# Altium project BiasTee.PrjPcb
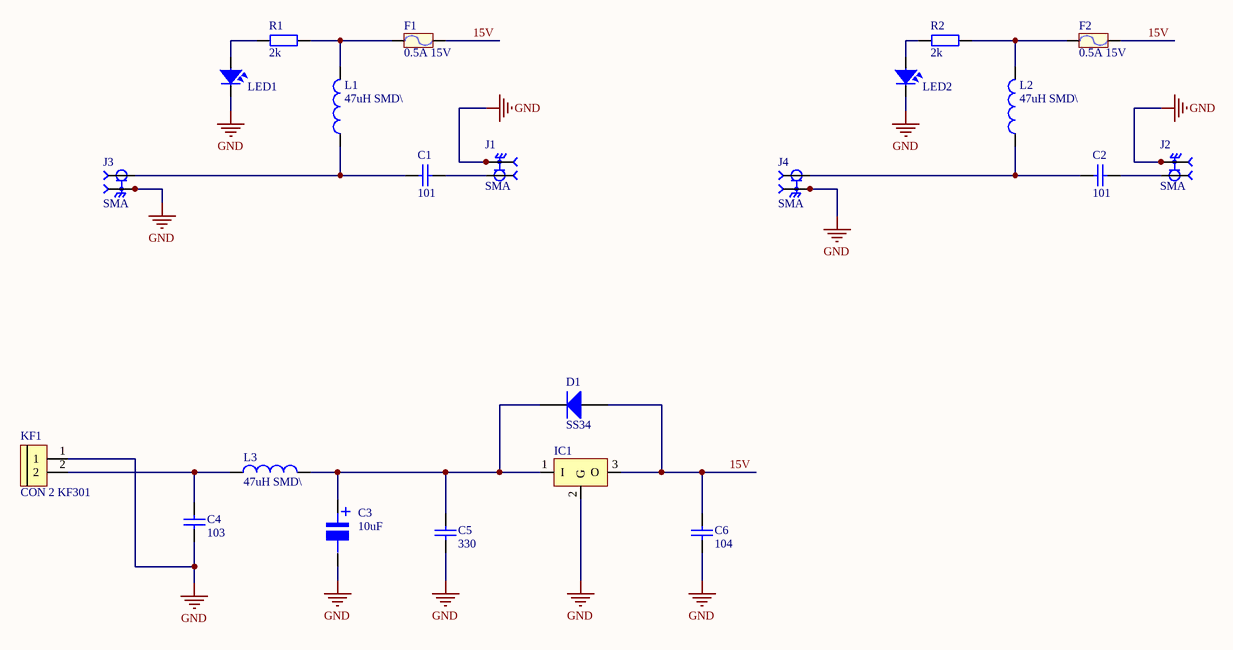
[diagram p0: BiasTee.SchDoc]
1 sheet, 22 parts. Net scope: global (net labels, ports and power ports of the same name join across sheets).
Board file: BiasTee.PcbDoc

## Sheet BiasTee.SchDoc: Dual Bias-Tee
size A4; Author: Nguyen Nhu Hai Long; CompanyName: HUST; SheetNumber: 1; SheetTotal: 1; Version: V.1.0.0

### Parts
C1  101  [tu 0805]
C2  101  [tu 0805]
C3  10uF  [tu nhom 5 (c)]
C4  103  [tu 1206]
C5  330  [tu 1206]
C6  104  [tu 1206]
D1  SS34  [DIODE SMA]
F1  0.5A 15V  [Cau chi tu phuc hoi 2A 24V SMD1812]
F2  0.5A 15V  [Cau chi tu phuc hoi 2A 24V SMD1812]
IC1  LM78xx  [TO220H1]  (value not drawn)
J1  SMA  [RFSOLUTIONS_CON-SMA-EDGE-S]
J2  SMA  [RFSOLUTIONS_CON-SMA-EDGE-S]
J3  SMA  [RFSOLUTIONS_CON-SMA-EDGE-S]
J4  SMA  [RFSOLUTIONS_CON-SMA-EDGE-S]
KF1  CON 2 KF301  [Con 2 KF301 5.08]
L1  47uH SMD\  [IND_1210]
L2  47uH SMD\  [IND_1210]
L3  47uH SMD\  [IND_1210]
LED1  LED  [LED-1206-Green]  (value not drawn)
LED2  LED  [LED-1206-Green]  (value not drawn)
R1  2k  [tro smd 0805]
R2  2k  [tro smd 0805]

### Nets
GND: C3.2 C4.2 C5.2 C6.2 IC1.2(G) J1.G1 J1.G2 J1.G3 J1.G4 J2.G1 J2.G2 J2.G3 J2.G4 J3.G1 J3.G2 J3.G3 J3.G4 J4.G1 J4.G2 J4.G3 J4.G4 KF1.1 LED1.2 LED2.2
15V: C6.1 D1.1(A) F1.2 F2.2 IC1.3(O)
NetC1_1: C1.1 J1.1
NetC1_2: C1.2 J3.1 L1.1
NetC2_1: C2.1 J2.1
NetC2_2: C2.2 J4.1 L2.1
NetC3_1: C3.1 C5.1 D1.2(K) IC1.1(I) L3.2
NetC4_1: C4.1 KF1.2 L3.1
NetF1_1: F1.1 L1.2 R1.2
NetF2_1: F2.1 L2.2 R2.2
NetLED1_1: LED1.1 R1.1
NetLED2_1: LED2.1 R2.1

### Notes on the sheet
- PROJECT:
- VERSION:
- Document type
- START DATE:
- Mission
- Design
- Name
- Date
- Page
- /
- Size
- A4
- Page Contents
- Review
- SIGNAL PROCESSING AND RADIO COMMUNICATIONS
- SEEE - HUST
- Approve
- LABORATORY - SPARC LAB
- (in symbol Tu Nhom 10uF 20V) +

### Library data of the parts
C1 C2 = Tu 0805 101 50V 20%: Dán; Don_Vi: Con; So_Chan: 2; Ten_Linh_Kien: Tụ 0805 101-0.1nF 50V 20%; Ma_Hang: MH002806; Chung_Loai: Dán; Kieu_Chan: *
C3 = Tu Nhom 10uF 20V: Dán; Don_Vi: Con; So_Chan: 2; Ten_Linh_Kien: Tụ Nhôm 10uF 20V; Ma_Hang: MH004016; Chung_Loai: Dán; Kieu_Chan: *
C4-C6 = Tu 1206 103 50V 10%: Dán; Don_Vi: Con; So_Chan: 2; Ten_Linh_Kien: Tụ 1206 103-10nF 10% 50V; Ma_Hang: MH004543; Chung_Loai: Dán; Kieu_Chan: *
D1 = Diode SS34 ( 1N5822 ): Dán; Don_Vi: Con; Ma_Hang: MH002104; Ten_Linh_Kien: Diode SS34 3A 40V SMA ( 1N5822 SS34A); Kieu_Chan: *; Chung_Loai: Dán
F1 F2 = Cau chi tu phuc hoi 2A 24V SMD1812: 2A 24V SMD1812; Ma_Hang: MH010033; Ten: Cầu Chì Tự Phục Hồi 2A 24V SMD1812
IC1 = LM78xx: Positive Voltage Regulator; Note: Tab is connected to pin 3 (GND).; Published: 24-Aug-2001; LatestRevisionDate: 17-Jul-2002; LatestRevisionNote: Re-released for DXP Platform.; DatasheetVersion: Apr-1994; PackageVersion: Jul-1998; PackageReference: ISOWATT220AB; Publisher: Altium Limited; PackageDescription: TO, Thru-Hole, Vertical, Heatsink Mounted; 3 In-Line Leads; Pitch 2.54 mm; Pin sequence 1, 3, 2; ComponentLink1Description: Manufacturer Link; ComponentLink1URL: http://www.st.com/; ComponentLink2Description: Datasheet; ComponentLink2URL: http://www.st.com/stonline/products/literature/ds/2146/l78m05c.pdf
J1-J4 = CON-SMA-EDGE-S: SMA Connector Jack, Female Socket - Board Edge, End Launch Solder; MF: RF Solutions; Value: *; SnapEDA_Link: https://www.snapeda.com/parts/CON-SMA-EDGE-S/RF+Solutions/view-part/?ref=snap; Purchase-URL: https://pricing.snapeda.com/search/part/CON-SMA-EDGE-S/?ref=eda; Check_prices: https://www.snapeda.com/parts/CON-SMA-EDGE-S/RF+Solutions/view-part/?ref=eda; Digi-Key_Part_Number: CON-SMA-EDGE-S-ND; Package: None; MP: CON-SMA-EDGE-S
KF1 = CON 2 KF301: Cắm; Ma_Hang: MH000987; Ten_Linh_Kien: CON 2 KF301-2P 5.08MM Xanh Dương; Chung_Loai: Cắm; Ghi_Chu: *; Kieu_Chan: *; Don_Vi: Con
L1-L3 = IND_18uH-0.12A-10%-SMD: Fixed Inductors 18uH 10% 2.52MHz; Manufacturer: Wurth Electronics; Manufacturer Part Number: CMH322522-180KL; Alternate Part Number-1: NA; Case/Package: SMD; Supplier-1: ARROW; Supplier Part Number-1: CMH322522-180KL
LED1 LED2 = LED SMD: Value: LED 3 - 5 ly 2 Colour
R1 R2 = Tro 0805 1% 2k: Dán; Don_Vi: Con; So_Chan: 2; Ten_Linh_Kien: Trở 0805 1% 2k; Ma_Hang: MH005471; Chung_Loai: Dán; Kieu_Chan: *